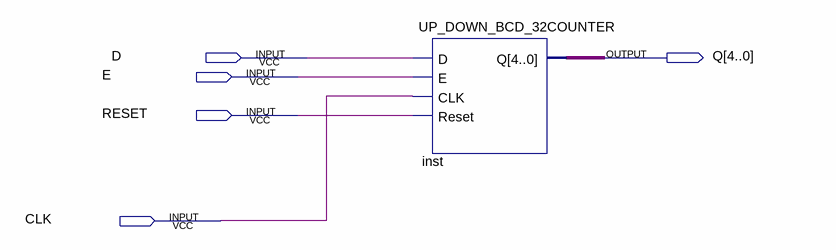
[diagram p0: schematic sheet]
// Quartus schematic BCD_COUNTER.bdf as structural Verilog: 1 symbols, 5 pins
module BCD_COUNTER (
  input  D,
  input  E,
  input  RESET,
  input  CLK,
  output [4:0] Q
);

  UP_DOWN_BCD_32COUNTER inst (.D(D), .E(E), .CLK(CLK), .Reset(RESET), .Q(Q));
endmodule
